# EAGLE schematic General IO (EAGLE 4.13)
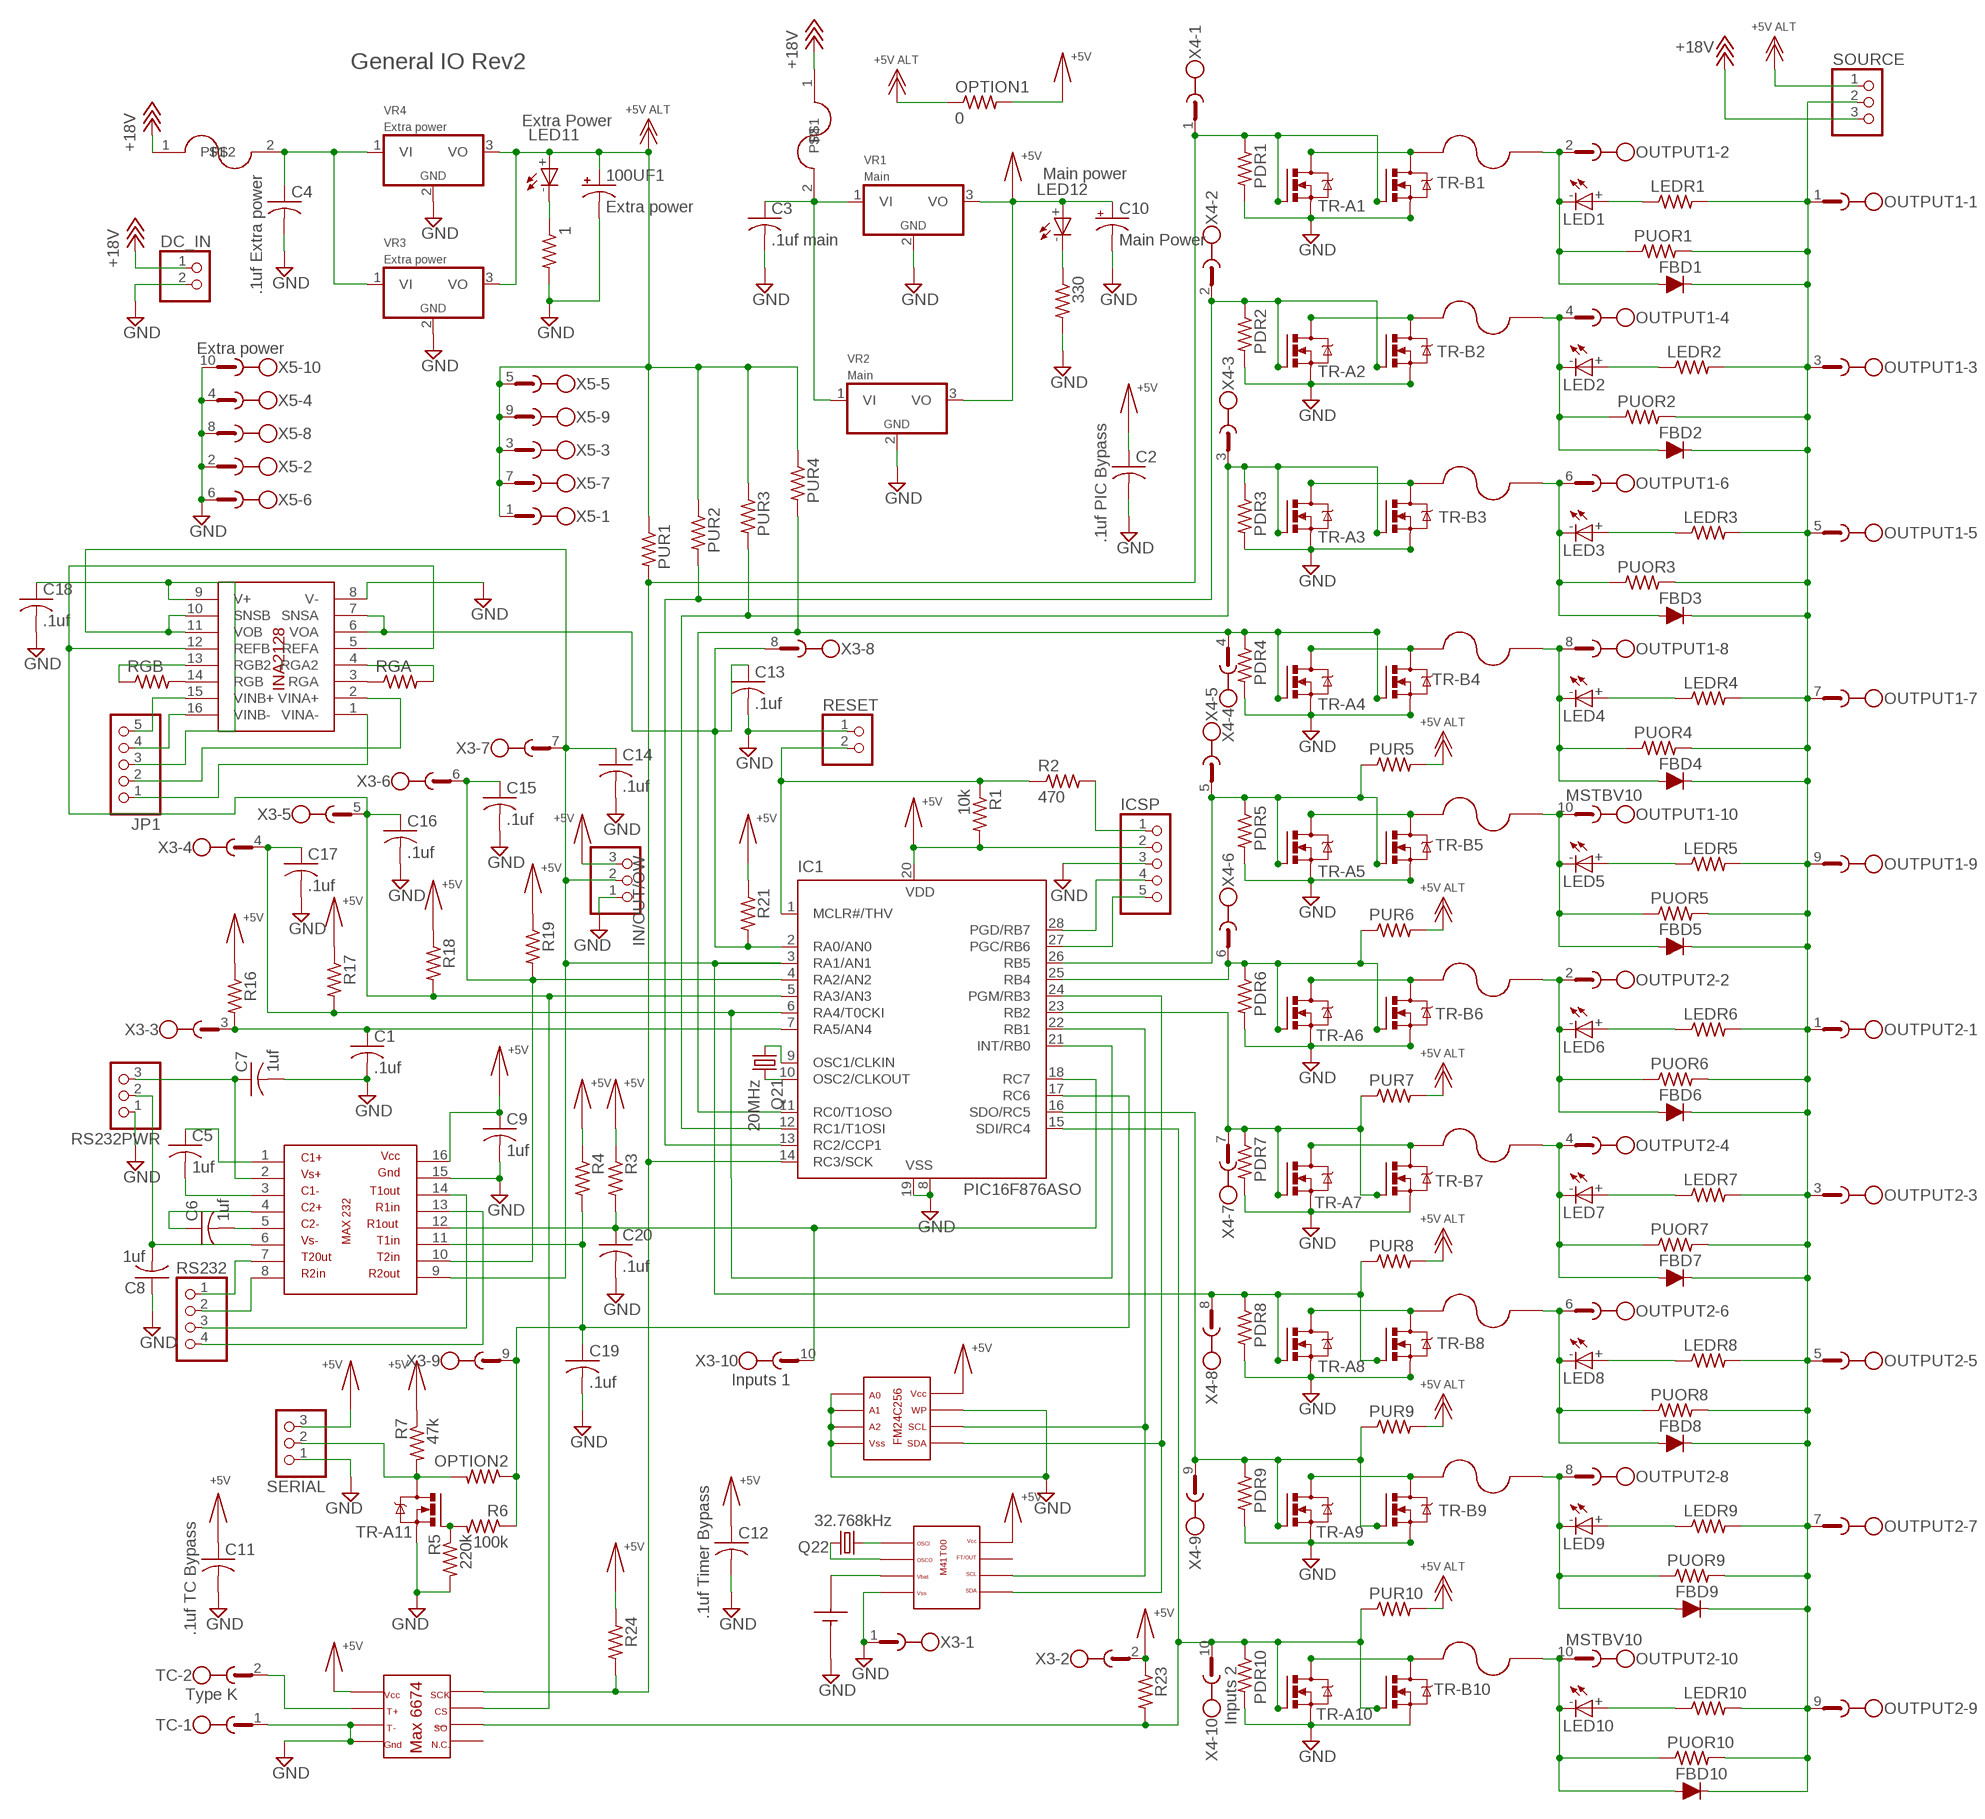
[diagram p0: schematic, sheet 1]

## Parts
1  RESISITORR1210  [R1210]
100UF1  Extra power  CAPACITOR-ELECTROLYTICG  [PANASONIC_G]
330  RESISITORR1210  [R1210]
BAT1  BH-401  [BH-401]
C1  .1uf  CAPACITOR-NO-POLARITYC1210  [C1210]
C2  .1uf PIC Bypass  CAPACITOR-NO-POLARITYC1210  [C1210]
C3  .1uf main  CAPACITOR-NO-POLARITYC1210  [C1210]
C4  .1uf Extra power  CAPACITOR-NO-POLARITYC1210  [C1210]
C5  1uf  CAPACITOR-NO-POLARITYC1210  [C1210]
C6  1uf  CAPACITOR-NO-POLARITYC1210  [C1210]
C7  1uf  CAPACITOR-NO-POLARITYC1210  [C1210]
C8  1uf  CAPACITOR-NO-POLARITYC1210  [C1210]
C9  1uf  CAPACITOR-NO-POLARITYC1210  [C1210]
C10  Main Power  CAPACITOR-ELECTROLYTICG  [PANASONIC_G]
C11  .1uf TC Bypass  CAPACITOR-NO-POLARITYC1210  [C1210]
C12  .1uf Timer Bypass  CAPACITOR-NO-POLARITYC1210  [C1210]
C13  .1uf  CAPACITOR-NO-POLARITYC1210  [C1210]
C14  .1uf  CAPACITOR-NO-POLARITYC1210  [C1210]
C15  .1uf  CAPACITOR-NO-POLARITYC1210  [C1210]
C16  .1uf  CAPACITOR-NO-POLARITYC1210  [C1210]
C17  .1uf  CAPACITOR-NO-POLARITYC1210  [C1210]
C18  .1uf  CAPACITOR-NO-POLARITYC1210  [C1210]
C19  .1uf  CAPACITOR-NO-POLARITYC1210  [C1210]
C20  .1uf  CAPACITOR-NO-POLARITYC1210  [C1210]
DC_IN  PINHD-1X2  [1X02]
FBD1  D-FILL-SOD-87  [SOD87]
FBD2  D-FILL-SOD-87  [SOD87]
FBD3  D-FILL-SOD-87  [SOD87]
FBD4  D-FILL-SOD-87  [SOD87]
FBD5  D-FILL-SOD-87  [SOD87]
FBD6  D-FILL-SOD-87  [SOD87]
FBD7  D-FILL-SOD-87  [SOD87]
FBD8  D-FILL-SOD-87  [SOD87]
FBD9  D-FILL-SOD-87  [SOD87]
FBD10  D-FILL-SOD-87  [SOD87]
FUSE1  FUSE(SM)  [FUSE]
FUSE2  FUSE(SM)  [FUSE]
FUSE3  FUSE(SM)  [FUSE]
FUSE4  FUSE(SM)  [FUSE]
FUSE5  FUSE(SM)  [FUSE]
FUSE6  FUSE(SM)  [FUSE]
FUSE7  FUSE(SM)  [FUSE]
FUSE8  FUSE(SM)  [FUSE]
FUSE9  FUSE(SM)  [FUSE]
FUSE10  FUSE(SM)  [FUSE]
IC1  PIC16F876ASO  PIC16F876SO  [SO-28W]
ICSP  PINHD-1X5  [1X05]
IN/OUT/OW  PINHD-1X3  [1X03]
JP1  PINHD-1X5  [1X05]
LED1  LED  [1206]
LED2  LED  [1206]
LED3  LED  [1206]
LED4  LED  [1206]
LED5  LED  [1206]
LED6  LED  [1206]
LED7  LED  [1206]
LED8  LED  [1206]
LED9  LED  [1206]
LED10  LED  [1206]
LED11  Extra Power  LED  [1206]
LED12  Main power  LED  [1206]
LEDR1  RESISITORM1406  [M1406]
LEDR2  RESISITORM1406  [M1406]
LEDR3  RESISITORM1406  [M1406]
LEDR4  RESISITORM1406  [M1406]
LEDR5  RESISITORM1406  [M1406]
LEDR6  RESISITORM1406  [M1406]
LEDR7  RESISITORM1406  [M1406]
LEDR8  RESISITORM1406  [M1406]
LEDR9  RESISITORM1406  [M1406]
LEDR10  RESISITORM1406  [M1406]
OPTION1  0  RESISITORM1406  [M1406]
OPTION2  RESISITORM1406  [M1406]
OUTPUT1  MSTBV10  [MSTBV10]
OUTPUT2  MSTBV10  [MSTBV10]
PDR1  RESISITORM1406  [M1406]
PDR2  RESISITORM1406  [M1406]
PDR3  RESISITORM1406  [M1406]
PDR4  RESISITORM1406  [M1406]
PDR5  RESISITORM1406  [M1406]
PDR6  RESISITORM1406  [M1406]
PDR7  RESISITORM1406  [M1406]
PDR8  RESISITORM1406  [M1406]
PDR9  RESISITORM1406  [M1406]
PDR10  RESISITORM1406  [M1406]
POLYFUSE1  Extra Power  POLYFUSE  [0204/5]
POLYFUSE2  Main power  POLYFUSE  [0204/5]
PUOR1  RESISITORM1406  [M1406]
PUOR2  RESISITORM1406  [M1406]
PUOR3  RESISITORM1406  [M1406]
PUOR4  RESISITORM1406  [M1406]
PUOR5  RESISITORM1406  [M1406]
PUOR6  RESISITORM1406  [M1406]
PUOR7  RESISITORM1406  [M1406]
PUOR8  RESISITORM1406  [M1406]
PUOR9  RESISITORM1406  [M1406]
PUOR10  RESISITORM1406  [M1406]
PUR1  RESISITORM1406  [M1406]
PUR2  RESISITORM1406  [M1406]
PUR3  RESISITORM1406  [M1406]
PUR4  RESISITORM1406  [M1406]
PUR5  RESISITORM1406  [M1406]
PUR6  RESISITORM1406  [M1406]
PUR7  RESISITORM1406  [M1406]
PUR8  RESISITORM1406  [M1406]
PUR9  RESISITORM1406  [M1406]
PUR10  RESISITORM1406  [M1406]
Q21  20MHz  CRYSTALSM49  [SM49]
Q22  32.768kHz  CRYSTALTC26H  [TC26H]
R1  10k  RESISITORM1406  [M1406]
R2  470  RESISITORM1406  [M1406]
R3  RESISITORM1406  [M1406]
R4  RESISITORM1406  [M1406]
R5  220k  RESISITORM1406  [M1406]
R6  100k  RESISITORM1406  [M1406]
R7  47k  RESISITORM1406  [M1406]
R16  RESISITORM1406  [M1406]
R17  RESISITORM1406  [M1406]
R18  RESISITORM1406  [M1406]
R19  RESISITORM1406  [M1406]
R21  RESISITORM1406  [M1406]
R23  RESISITORM1406  [M1406]
R24  RESISITORM1406  [M1406]
RESET  PINHD-1X2  [1X02]
RGA  RESISITORM1406  [M1406]
RGB  RESISITORM1406  [M1406]
RS232  PINHD-1X4  [1X04]
RS232PWR  PINHD-1X3  [1X03]
SERIAL  PINHD-1X3  [1X03]
SOURCE  PINHD-1X3  [1X03]
TC  Type K  MST2V  [MSTBV2]
TR-A1  ZXMN10A08GSOT223  [SOT223R_INFINEON]
TR-A2  ZXMN10A08GSOT223  [SOT223R_INFINEON]
TR-A3  ZXMN10A08GSOT223  [SOT223R_INFINEON]
TR-A4  ZXMN10A08GSOT223  [SOT223R_INFINEON]
TR-A5  ZXMN10A08GSOT223  [SOT223R_INFINEON]
TR-A6  ZXMN10A08GSOT223  [SOT223R_INFINEON]
TR-A7  ZXMN10A08GSOT223  [SOT223R_INFINEON]
TR-A8  ZXMN10A08GSOT223  [SOT223R_INFINEON]
TR-A9  ZXMN10A08GSOT223  [SOT223R_INFINEON]
TR-A10  ZXMN10A08GSOT223  [SOT223R_INFINEON]
TR-A11  ZXMN10A08GSOT223  [SOT223R_INFINEON]
TR-B1  ZXMN10A08G  [TO220BV]
TR-B2  ZXMN10A08G  [TO220BV]
TR-B3  ZXMN10A08G  [TO220BV]
TR-B4  ZXMN10A08G  [TO220BV]
TR-B5  ZXMN10A08G  [TO220BV]
TR-B6  ZXMN10A08G  [TO220BV]
TR-B7  ZXMN10A08G  [TO220BV]
TR-B8  ZXMN10A08G  [TO220BV]
TR-B9  ZXMN10A08G  [TO220BV]
TR-B10  ZXMN10A08G  [TO220BV]
U$1  MAX232  [SO16]
U$2  MAX6674  [SO08]
U$4  M41T00TIMER-I2C  [SO08]
U$16  INA2128  [MO004-16]
U$18  FM24C256  [SO08]
VR1  Main  VOLTAGE-REGULATOR  [TO220S]
VR2  Main  VOLTAGE-REGULATORSO-223  [SOT223R_INFINEON]
VR3  Extra power  VOLTAGE-REGULATORSO-223  [SOT223R_INFINEON]
VR4  Extra power  VOLTAGE-REGULATOR  [TO220S]
X3  Inputs 1  MSTBV10  [MSTBV10]
X4  Inputs 2  MSTBV10  [MSTBV10]
X5  Extra power  MSTBV10  [MSTBV10]

## Nets
$N199: IC1.15(SDI/RC4) PDR10.1 PUR10.1 R23.2 TR-A10.1(G) TR-B10.G U$2.7 X4.10
+5V: C2.1 C9.1 C10.+ C11.1 C12.1 IC1.20(VDD) ICSP.2 IN/OUT/OW.3 LED12.+ OPTION1.2 R1.2 R3.1 R4.1 R7.1 R16.1 R17.1 R18.1 R19.1 R21.1 R23.1 R24.1 SERIAL.3 U$1.16 U$2.4 U$4.8(VCC) U$18.8(VDD) VR1.3(VO) VR2.3(VO) X3.2
+18V: DC_IN.1 POLYFUSE1.1 POLYFUSE2.1 SOURCE.3
ALT5V: 100UF1.+ LED11.+ OPTION1.1 PUR1.1 PUR2.1 PUR3.1 PUR4.1 PUR5.2 PUR6.2 PUR7.2 PUR8.2 PUR9.2 PUR10.2 SOURCE.1 VR3.3(VO) VR4.3(VO) X5.1 X5.3 X5.5 X5.7 X5.9
GND: 1.2 100UF1.- 330.2 BAT1.P$2 C1.2 C2.2 C3.2 C4.2 C7.2 C8.1 C9.2 C10.- C11.2 C12.2 C13.2 C14.2 C15.2 C16.2 C17.2 C18.2 C19.2 C20.2 DC_IN.2 IC1.8(VSS) IC1.19(VSS) ICSP.3 IN/OUT/OW.1 PDR1.2 PDR2.2 PDR3.2 PDR4.2 PDR5.2 PDR6.2 PDR7.2 PDR8.2 PDR9.2 PDR10.2 R5.2 RESET.1 RS232PWR.1 SERIAL.1 TC.1 TR-A1.3(S) TR-A2.3(S) TR-A3.3(S) TR-A4.3(S) TR-A5.3(S) TR-A6.3(S) TR-A7.3(S) TR-A8.3(S) TR-A9.3(S) TR-A10.3(S) TR-A11.3(S) TR-B1.S TR-B2.S TR-B3.S TR-B4.S TR-B5.S TR-B6.S TR-B7.S TR-B8.S TR-B9.S TR-B10.S U$1.15 U$2.1 U$2.2 U$4.4(VSS) U$16.8(V-) U$18.1(A0) U$18.2(A1) U$18.3(A2) U$18.4(VSS) U$18.7(WP) VR1.2(GND) VR2.2(GND) VR3.2(GND) VR4.2(GND) X3.1 X5.2 X5.4 X5.6 X5.8 X5.10
N$1: FUSE7.P$1 TR-A7.2(D) TR-B7.D
N$2: FUSE9.P$1 TR-A9.2(D) TR-B9.D
N$3: IC1.25(RB4) PDR6.1 PUR6.1 TR-A6.1(G) TR-B6.G X4.6
N$4: FBD6.2(A) FUSE6.P$2 LED6.- OUTPUT2.2 PUOR6.1
N$5: FBD7.2(A) FUSE7.P$2 LED7.- OUTPUT2.4 PUOR7.1
N$6: FUSE6.P$1 TR-A6.2(D) TR-B6.D
N$7: FUSE8.P$1 TR-A8.2(D) TR-B8.D
N$8: IC1.23(RB2) PDR7.1 PUR7.1 TR-A7.1(G) TR-B7.G X4.7
N$9: FBD10.2(A) FUSE10.P$2 LED10.- OUTPUT2.10 PUOR10.1
N$10: FBD8.2(A) FUSE8.P$2 LED8.- OUTPUT2.6 PUOR8.1
N$11: IC1.16(SDO/RC5) PDR9.1 PUR9.1 TR-A9.1(G) TR-B9.G X4.9
N$12: C13.1 IC1.2(RA0/AN0) R21.2 U$16.6(VOA) U$16.7(SNSA) X3.8
N$13: FBD9.2(A) FUSE9.P$2 LED9.- OUTPUT2.8 PUOR9.1
N$14: FUSE10.P$1 TR-A10.2(D) TR-B10.D
N$15: C17.1 IC1.6(RA4/T0CKI) IC1.21(INT/RB0) R17.2 X3.4
N$16: FBD2.2(A) FUSE2.P$2 LED2.- OUTPUT1.4 PUOR2.1
N$17: FUSE5.P$1 TR-A5.2(D) TR-B5.D
N$18: FBD5.2(A) FUSE5.P$2 LED5.- OUTPUT1.10 PUOR5.1
N$19: RS232.1 U$1.7
N$20: IC1.26(RB5) PDR5.1 PUR5.1 TR-A5.1(G) TR-B5.G X4.5
N$21: FUSE4.P$1 TR-A4.2(D) TR-B4.D
N$22: FBD4.2(A) FUSE4.P$2 LED4.- OUTPUT1.8 PUOR4.1
N$23: FUSE3.P$1 TR-A3.2(D) TR-B3.D
N$24: FBD3.2(A) FUSE3.P$2 LED3.- OUTPUT1.6 PUOR3.1
N$25: IC1.12(RC1/T1OSI) PDR3.1 PUR3.2 TR-A3.1(G) TR-B3.G X4.3
N$26: IC1.14(RC3/SCK) PDR1.1 PUR1.2 R24.2 TR-A1.1(G) TR-B1.G U$2.5 X4.1
N$27: FUSE2.P$1 TR-A2.2(D) TR-B2.D
N$28: IC1.13(RC2/CCP1) PDR2.1 PUR2.2 TR-A2.1(G) TR-B2.G X4.2
N$29: FUSE1.P$1 TR-A1.2(D) TR-B1.D
N$30: FBD1.2(A) FUSE1.P$2 LED1.- OUTPUT1.2 PUOR1.1
N$31: IC1.28(PGD/RB7) ICSP.4
N$32: IC1.11(RC0/T1OSO) PDR4.1 PUR4.2 TR-A4.1(G) TR-B4.G X4.4
N$33: C1.1 IC1.7(RA5/AN4) R16.2 X3.3
N$34: ICSP.1 R2.2
N$35: IC1.10(OSC2/CLKOUT) Q21.2
N$36: R5.1 R6.2 TR-A11.1(G)
N$37: IC1.1(MCLR#/THV) R1.1 R2.1 RESET.2
N$38: OPTION2.2 R7.2 SERIAL.2 TR-A11.2(D)
N$39: IC1.9(OSC1/CLKIN) Q21.1
N$40: IC1.27(PGC/RB6) ICSP.5
N$41: C20.1 IC1.18(RC7) R3.2 U$1.12 X3.10
N$42: IC1.22(RB1) U$4.6(SCL) U$18.6(SCL)
N$43: C15.1 IC1.4(RA2/AN2) R19.2 U$1.10 X3.6
N$44: C19.1 IC1.17(RC6) OPTION2.1 R4.2 R6.1 U$1.11 X3.9
N$45: RS232.2 U$1.8
N$46: TC.2 U$2.3
N$47: C4.1 POLYFUSE1.2 VR3.1(VI) VR4.1(VI)
N$49: RS232.3 U$1.14
N$52: FBD1.1(C) FBD2.1(C) FBD3.1(C) FBD4.1(C) FBD5.1(C) FBD6.1(C) FBD7.1(C) FBD8.1(C) FBD9.1(C) FBD10.1(C) LEDR1.2 LEDR2.2 LEDR3.2 LEDR4.2 LEDR5.2 LEDR6.2 LEDR7.2 LEDR8.2 LEDR9.2 LEDR10.2 OUTPUT1.1 OUTPUT1.3 OUTPUT1.5 OUTPUT1.7 OUTPUT1.9 OUTPUT2.1 OUTPUT2.3 OUTPUT2.5 OUTPUT2.7 OUTPUT2.9 PUOR1.2 PUOR2.2 PUOR3.2 PUOR4.2 PUOR5.2 PUOR6.2 PUOR7.2 PUOR8.2 PUOR9.2 PUOR10.2 SOURCE.2
N$53: Q22.1 U$4.2(OSCO)
N$54: Q22.2 U$4.1(OSCI)
N$55: 330.1 LED12.-
N$56: BAT1.P$1 U$4.3(VBAT)
N$60: RS232.4 U$1.13
N$63: C3.1 POLYFUSE2.2 VR1.1(VI) VR2.1(VI)
N$64: LED10.+ LEDR10.1
N$65: LED9.+ LEDR9.1
N$66: 1.1 LED11.-
N$67: LED8.+ LEDR8.1
N$68: IC1.24(PGM/RB3) U$4.5(SDA) U$18.5(SDA)
N$69: LED7.+ LEDR7.1
N$70: LED6.+ LEDR6.1
N$71: LED5.+ LEDR5.1
N$72: LED4.+ LEDR4.1
N$73: LED3.+ LEDR3.1
N$74: LED2.+ LEDR2.1
N$75: LED1.+ LEDR1.1
N$77: JP1.5 U$16.15(VINB+)
N$80: C6.2 U$1.5
N$81: C5.2 U$1.3
N$82: C6.1 U$1.4
N$83: C5.1 U$1.1
N$84: C7.1 RS232PWR.3 U$1.2
N$85: C8.2 RS232PWR.2 U$1.6
N$86: JP1.4 U$16.16(VINB-)
N$87: C14.1 IC1.3(RA1/AN1) IN/OUT/OW.2 PDR8.1 PUR8.1 TR-A8.1(G) TR-B8.G U$1.9 U$16.10(SNSB) U$16.11(VOB) X3.7 X4.8
N$88: RGA.1 U$16.3(RGA)
N$89: RGB.2 U$16.14(RGB)
N$90: RGA.2 U$16.4(RGA2)
N$91: RGB.1 U$16.13(RGB2)
N$92: JP1.2 U$16.2(VINA+)
N$93: JP1.1 U$16.1(VINA-)
N$94: C18.1 JP1.3 U$16.9(V+)
N$95: C16.1 IC1.5(RA3/AN3) R18.2 U$2.6 U$16.5(REFA) U$16.12(REFB) X3.5
Unconnected: U$2.8 U$4.7(FT/OUT)

## Notes on the sheet
- General IO Rev2

## Library data of the parts
1 330 LEDR1-LEDR10 OPTION1 OPTION2 PDR1-PDR10 PUOR1-PUOR10 PUR1-PUR10 R1-R7 R16-R19 R21 R23 R24 RGA RGB = 1 Dan's Common Parts:RESISITOR: RESISTOR, American symbol
100UF1 C10 = 1 Dan's Common Parts:CAPACITOR-ELECTROLYTIC: POLARIZED CAPACITOR, American symbol
BAT1 = 1 Dan's Common Parts:BH-401
C1-C9 C11-C20 = 1 Dan's Common Parts:CAPACITOR-NO-POLARITY: CAPACITOR, American symbol
DC_IN RESET = pinhead:PINHD-1X2: PIN HEADER
FBD1-FBD10 = semicon-smd-ipc:D-FILL-: DIODE filled
FUSE1-FUSE10 = 1 Dan's Common Parts:FUSE(SM)
IC1 = 1 Dan's Common Parts:PIC16*876: MICROCONTROLLER flash type
ICSP JP1 = pinhead:PINHD-1X5: PIN HEADER
IN/OUT/OW RS232PWR SERIAL SOURCE = pinhead:PINHD-1X3: PIN HEADER
LED1-LED12 = 1 Dan's Common Parts:LED
OUTPUT1 OUTPUT2 X3-X5 = con-phoenix-508:MSTBV10: PHOENIX
POLYFUSE1 POLYFUSE2 = 1 Dan's Common Parts:POLYFUSE
Q21 Q22 = 1 Dan's Common Parts:CRYSTAL: CRYSTAL
RS232 = pinhead:PINHD-1X4: PIN HEADER
TC = con-phoenix-508:MST2V: PHOENIX
TR-A1-TR-A11 TR-B1-TR-B10 = 1 Dan's Common Parts:ZXMN10A08G: N-CHANNEL MOS FET
U$1 = 1 Dan's Common Parts:MAX232
U$2 = 1 Dan's Common Parts:MAX6674
U$4 = 1 Dan's Common Parts:M41T00TIMER-I2C
U$16 = 1 Dan's Common Parts:INA2128
U$18 = 1 Dan's Common Parts:FM24C256
VR1-VR4 = 1 Dan's Common Parts:VOLTAGE-REGULATOR: Positive VOLTAGE REGULATOR Source: http://cache.national.com/ds/LM/LM78L05.pdf http://www.fairchildsemi.com/ds/LM/LM7805.pdf